# Altium project PCB_DOAN2.PrjPcb
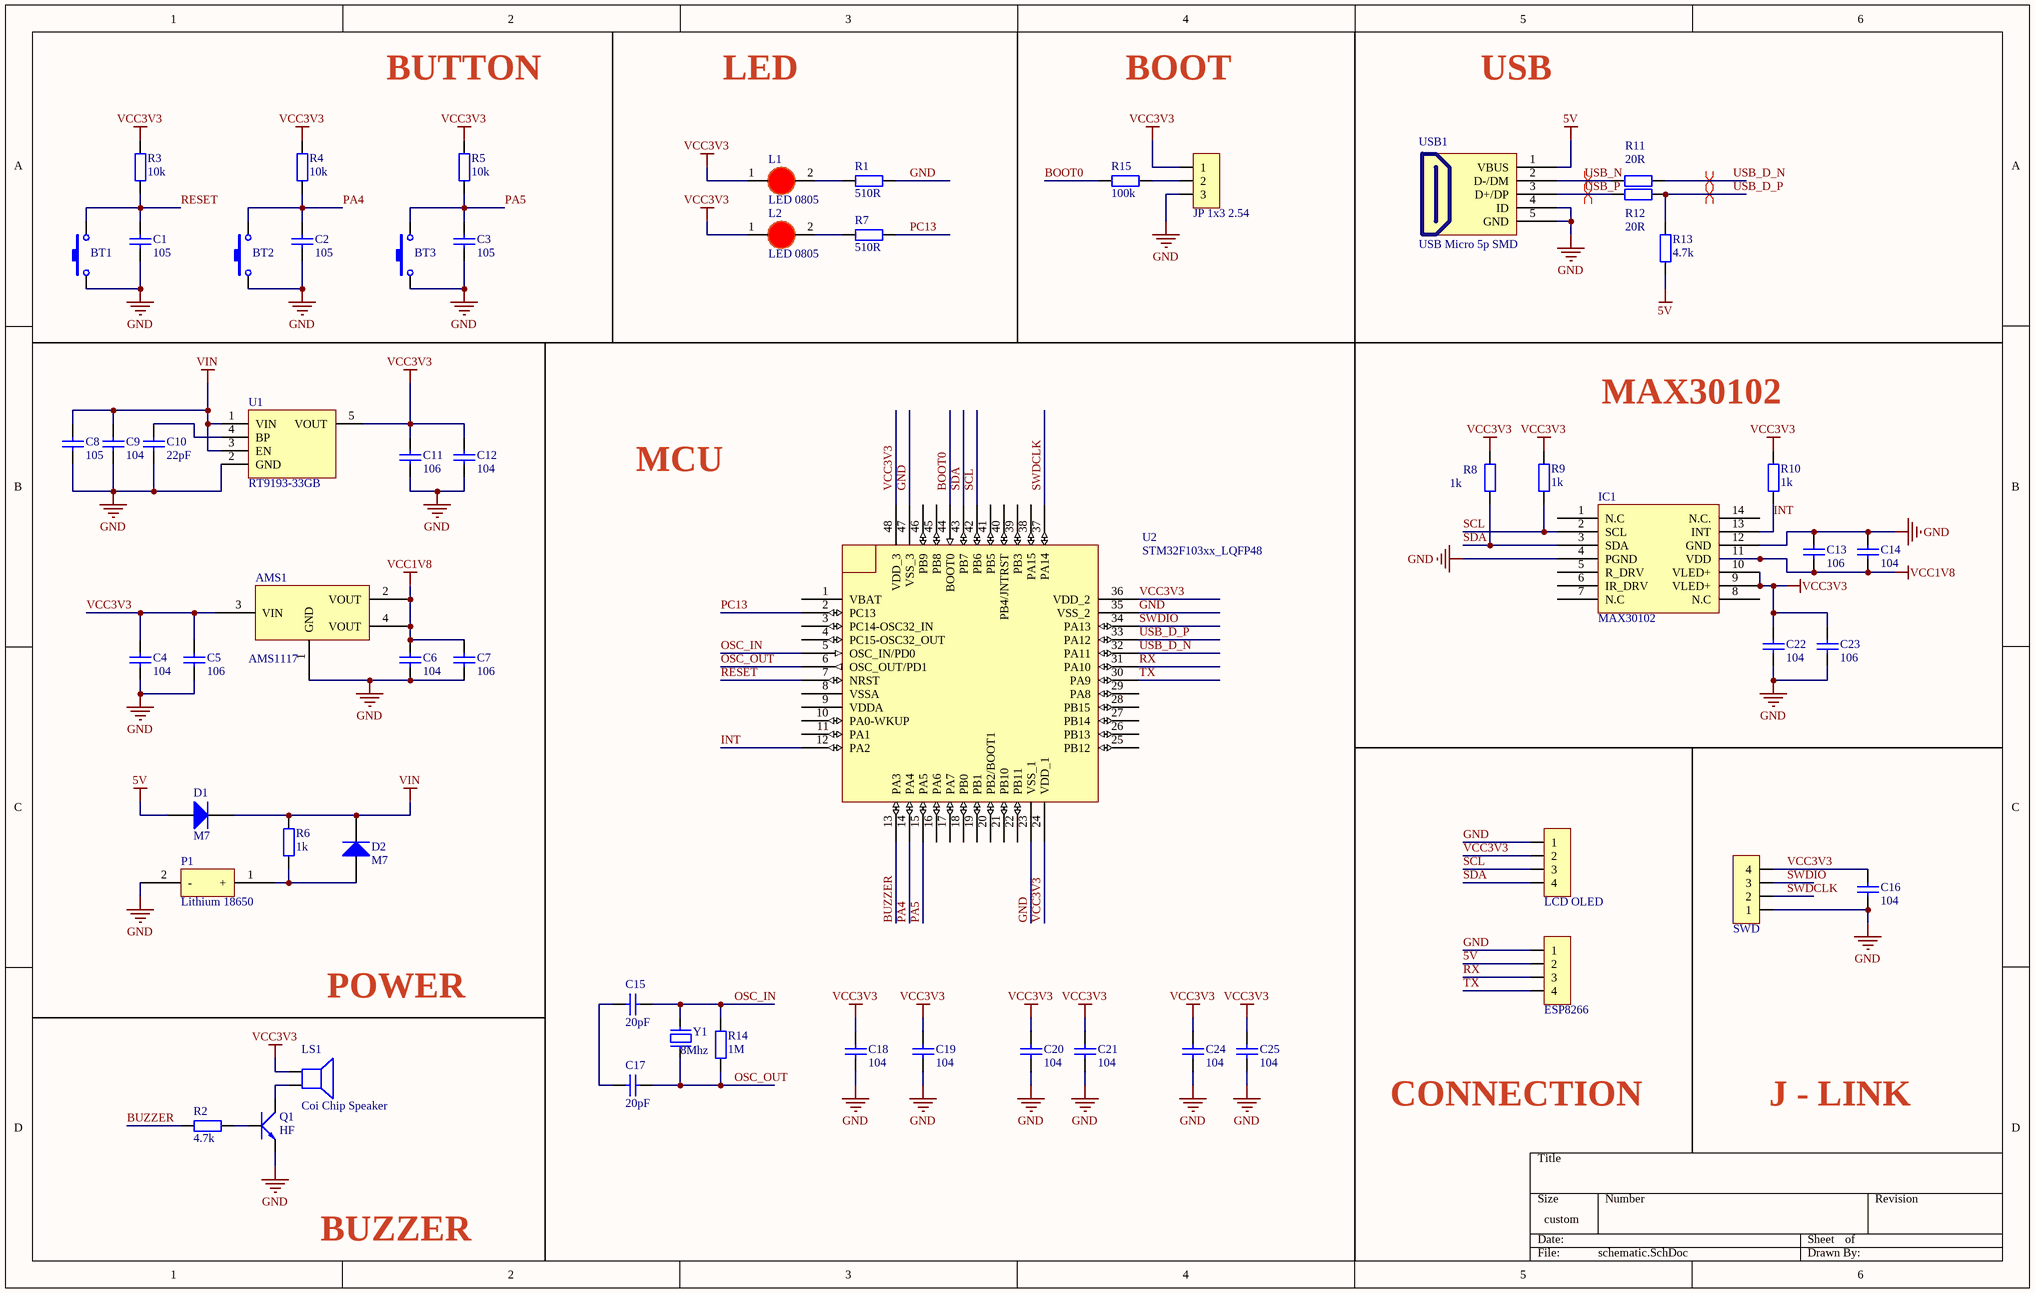
[diagram p0: schematic.SchDoc]
1 sheet, 60 parts. Net scope: global (net labels, ports and power ports of the same name join across sheets).
Board file: PCB1.PcbDoc

## Sheet schematic.SchDoc
size 381 x 241 mm; SheetNumber: 1; SheetTotal: 1

### Parts
AMS1  AMS1117  [SOT223]
BT1  Nut Nhan 2 Chan SMD 3x6x2.5  [Nut Nhan 2 Chan SMD 3x6x2.5]  (value not drawn)
BT2  Nut Nhan 2 Chan SMD 3x6x2.5  [Nut Nhan 2 Chan SMD 3x6x2.5]  (value not drawn)
BT3  Nut Nhan 2 Chan SMD 3x6x2.5  [Nut Nhan 2 Chan SMD 3x6x2.5]  (value not drawn)
C1  105  [tu 0603]
C2  105  [tu 0603]
C3  105  [tu 0603]
C4  104  [tu 0603]
C5  106  [tu 0603]
C6  104  [tu 0603]
C7  106  [tu 0603]
C8  105  [tu 0603]
C9  104  [tu 0603]
C10  22pF  [tu 0603]
C11  106  [tu 0603]
C12  104  [tu 0603]
C13  106  [tu 0603]
C14  104  [tu 0603]
C15  20pF  [tu 0805]
C16  104  [tu 0603]
C17  20pF  [tu 0805]
C18  104  [tu 0603]
C19  104  [tu 0603]
C20  104  [tu 0603]
C21  104  [tu 0603]
C22  104  [tu 0603]
C23  106  [tu 0603]
C24  104  [tu 0603]
C25  104  [tu 0603]
D1  M7  [DIODE SMA]
D2  M7  [DIODE SMA]
IC1  MAX30102  [Max30102]
JP1  SWD  [JP 1x4 DT]
JP2  LCD OLED  [JP 1x4 DT]
JP3  JP 1x3 2.54  [JP 1x3 DT]
JP4  ESP8266  [JP 1x4 DT]
L1  LED 0805  [LED-0805-Red]
L2  LED 0805  [LED-0805-Red]
LS1  Coi Chip Speaker  [Coi Chip Speacker]
P1  Lithium 18650  [18650_Lithium]
Q1  HF  [SOT-23]
R1  510R  [tro smd 0603]
R2  4.7k  [tro smd 0603]
R3  10k  [tro smd 0603]
R4  10k  [tro smd 0603]
R5  10k  [tro smd 0603]
R6  1k  [tro smd 0603]
R7  510R  [tro smd 0603]
R8  1k  [tro smd 0603]
R9  1k  [tro smd 0603]
R10  1k  [tro smd 0603]
R11  20R  [tro smd 0603]
R12  20R  [tro smd 0603]
R13  4.7k  [tro smd 0603]
R14  1M  [tro smd 0603]
R15  100k  [tro smd 0603]
U1  RT9193-33GB  [SOT23-5]
U2  STM32F103xx_LQFP48  [STM32_LQPF48]
USB1  USB Micro 5p SMD  [USB Micro 5p SMD]
Y1  8Mhz  [Thach Anh 2 chan SMD5032]

### Nets
5V: D1.1(A) JP4.2 R13.1 USB1.1(VBUS)
GND: AMS1.1(GND) BT1.1 BT2.1 BT3.1 C1.2 C2.2 C3.2 C4.1 C5.1 C6.1 C7.1 C8.2 C9.2 C10.2 C11.2 C12.2 C13.1 C14.1 C16.2 C18.2 C19.2 C20.2 C21.2 C22.1 C23.1 C24.2 C25.2 IC1.4(PGND) IC1.12(GND) JP1.1 JP2.1 JP3.3 JP4.1 P1.2(-) Q1.2(E) R1.2 U1.2(GND) U2.23(VSS_1) U2.35(VSS_2) U2.47(VSS_3) USB1.4(ID) USB1.5(GND)
VCC1V8: AMS1.2(VOUT) AMS1.4(VOUT) C6.2 C7.2 C13.2 C14.2 IC1.11(VDD)
VCC3V3: AMS1.3(VIN) C4.2 C5.2 C11.1 C12.1 C16.1 C18.1 C19.1 C20.1 C21.1 C22.2 C23.2 C24.1 C25.1 IC1.9(VLED+) IC1.10(VLED+) JP1.4 JP2.2 JP3.1 L1.1(A) L2.1(A) LS1.1 R3.2 R4.2 R5.2 R8.2 R9.1 R10.1 U1.5(VOUT) U2.24(VDD_1) U2.36(VDD_2) U2.48(VDD_3)
VIN: C8.1 C9.1 D1.2(K) D2.2(K) R6.2 U1.1(VIN) U1.3(EN)
BOOT0: R15.1 U2.44(BOOT0)
BUZZER: R2.1 U2.13(PA3)
INT: IC1.13(INT) R10.2 U2.12(PA2)
OSC_IN: C15.1 R14.2 U2.5(OSC_IN/PD0) Y1.2
OSC_OUT: C17.1 R14.1 U2.6(OSC_OUT/PD1) Y1.1
PA4: BT2.2 C2.1 R4.1 U2.14(PA4)
PA5: BT3.2 C3.1 R5.1 U2.15(PA5)
PC13: R7.2 U2.2(PC13)
RESET: BT1.2 C1.1 R3.1 U2.7(NRST)
RX: JP4.3 U2.31(PA10)
SCL: IC1.2(SCL) JP2.3 R9.2 U2.42(PB6)
SDA: IC1.3(SDA) JP2.4 R8.1 U2.43(PB7)
SWDCLK: JP1.2 U2.37(PA14)
SWDIO: JP1.3 U2.34(PA13)
TX: JP4.4 U2.30(PA9)
USB_D_N: R11.2 U2.32(PA11)
USB_D_P: R12.2 R13.2 U2.33(PA12)
USB_N: R11.1 USB1.2(D-/DM)
USB_P: R12.1 USB1.3(D+/DP)
NetC10_1: C10.1 U1.4(BP)
NetC15_2: C15.2 C17.2
NetD2_1: D2.1(A) P1.1(+) R6.1
NetJP3_2: JP3.2 R15.2
NetL1_2: L1.2(K) R1.1
NetL2_2: L2.2(K) R7.1
NetLS1_2: LS1.2 Q1.3(C)
NetQ1_1: Q1.1(B) R2.2

Not connected (* = marked no-connect by the designer): IC1 1(N.C) 5(R_DRV) 6(IR_DRV) 7(N.C) 8(N.C) 14(N.C.); U2 1(VBAT) 3(PC14-OSC32_IN) 4(PC15-OSC32_OUT) 8(VSSA) 9(VDDA) 10(PA0-WKUP) 11(PA1) 16(PA6) 17(PA7) 18(PB0) 19(PB1) 20(PB2/BOOT1) 21(PB10) 22(PB11) 25(PB12) 26(PB13) 27(PB14) 28(PB15) 29(PA8) 38(PA15) 39(PB3) 40(PB4/JNTRST) 41(PB5) 45(PB8) 46(PB9)

### Layout directives
differential pair: USB_D_N, USB_D_P, USB_N, USB_P

### Notes on the sheet
- BUTTON
- LED
- BOOT
- USB
- MAX30102
- MCU
- POWER
- CONNECTION
- J - LINK
- BUZZER

### Library data of the parts
AMS1 = AMS1117 SMD: Dán; Value: AMS1117-3.3V SOT223; Don_Vi: Con; Ma_Hang: MH000596; Ghi_Chu: *; Kieu_Chan: *; Chung_Loai: Dán
BT1-BT3 = Nut Nhan 2 Chan SMD 3x6x2.5: Ma_Hang: MH001036; Ten: Nút Nhấn 2 Chân 3x6x2.5MM SMD
C1-C3 = Tu 0603 105 50V 10%: Dán; Don_Vi: Con; So_Chan: 2; Ten_Linh_Kien: Tụ 0603 105-1uF 50V 10%; Ma_Hang: MH004569; Chung_Loai: Dán; Kieu_Chan: *
C4 C6 C9 C12 C14 C16 C18-C22 C24 C25 = Tu 0603 104 50V 10%: Dán; Don_Vi: Con; So_Chan: 2; Ten_Linh_Kien: Tụ 0603 104-100nF 10% 50V; Ma_Hang: MH004568; Chung_Loai: Dán; Kieu_Chan: *
C5 C7 C11 C13 C23 = Tu 0603 106 16V 20%: Dán; Don_Vi: Con; So_Chan: 2; Ten_Linh_Kien: Tụ 0603-10uF 20% 16V; Ma_Hang: MH004848; Chung_Loai: Dán; Kieu_Chan: *
C8 = Tu 0603 105 16V 20%: Dán; Don_Vi: Con; So_Chan: 2; Ten_Linh_Kien: Tụ 0603 105-1uF 20% 16V; Ma_Hang: MH004574; Chung_Loai: Dán; Kieu_Chan: *
C10 = Tu 0603 22pF 50V 10%: Dán; Don_Vi: Con; So_Chan: 2; Ten_Linh_Kien: Tụ 0603 22pF 50V 10%; Ma_Hang: MH004570; Chung_Loai: Dán; Kieu_Chan: *
C15 C17 = Tu 0805 20pF 50V 10%: Dán; Don_Vi: Con; Ten_Linh_Kien: Tụ 0805 20P 10% 50V; So_Chan: 2; Ma_Hang: MH004558; Chung_Loai: Dán; Kieu_Chan: *
D1 D2 = Diode M7 ( 4007 ): Dán; Don_Vi: Con; Ten_Linh_Kien: Diode M7 1N4007 SMD 1A 1000V; Ma_Hang: MH000944; Chung_Loai: Dán; Ghi_Chu: *
JP1 JP2 JP4 = JP 1x4 2.54 Duc Thang: Cắm; Ten_Linh_Kien: Jump Đơn Đực 2.54MM 1x40P Thẳng 11MM; Don_Vi: Con; Ma_Hang: MH000903; Ghi_Chu: *; Kieu_Chan: *; Chung_Loai: Cắm
JP3 = JP 1x3 2.54 Duc Thang: Cắm; Ten_Linh_Kien: Jump Đơn Đực 2.54MM 1x40P Thẳng 11MM; Don_Vi: Con; Ma_Hang: MH000903; Ghi_Chu: *; Kieu_Chan: *; Chung_Loai: Cắm
L1 L2 = LED 0805 Do: Dán; Don_Vi: Con; Ma_Hang: MH000897; Ten_Linh_Kien: LED 0805 Màu Đỏ (Red); Ghi_Chu: *; Kieu_Chan: *; Chung_Loai: Dán
LS1 = Coi Chip Speaker: Còi chip
Q1 = Trans C1815 HF SMD: SOT-23; Value: C9014
R1 R7 = Tro 0603 5% 510R: Dán; Don_Vi: Con; So_Chan: 2; Ten_Linh_Kien: Trở 0603 5% 510R; Ma_Hang: MH007667; Chung_Loai: Dán; Kieu_Chan: *
R2 R8-R10 R13 = Tro 0603 5% 4.7k: Dán; Don_Vi: Con; So_Chan: 2; Ten_Linh_Kien: Trở 0603 5% 4.7k; Ma_Hang: MH006327; Chung_Loai: Dán; Kieu_Chan: *
R3-R5 = Tro 0603 1% 10k: Dán; Don_Vi: Con; So_Chan: 2; Ten_Linh_Kien: Trở 0603 1% 10k; Ma_Hang: MH006333; Chung_Loai: Dán; Kieu_Chan: *
R6 = Tro 0603 5% 1k: Dán; Don_Vi: Con; So_Chan: 2; Ten_Linh_Kien: Trở 0603 5% 1k; Ma_Hang: MH006319; Chung_Loai: Dán; Kieu_Chan: *
R11 R12 = Tro 0603 5% 22R: Dán; Don_Vi: Con; So_Chan: 2; Ten_Linh_Kien: Trở 0603 5% 22R; Ma_Hang: MH006331; Chung_Loai: Dán; Kieu_Chan: *
R14 = Tro 0603 5% 1M: Dán; Don_Vi: Con; So_Chan: 2; Ten_Linh_Kien: Trở 0603 5% 1M; Ma_Hang: MH006909; Chung_Loai: Dán; Kieu_Chan: *
R15 = Tro 0603 5% 100k: Dán; So_Chan: 2; Ten_Linh_Kien: Trở 0603 5% 100k; Ma_Hang: MH006314; Don_Vi: Con; Chung_Loai: Dán; Kieu_Chan: *
U1 = REG_5.5V-3.3V-0.3A-1W-SOT-23-5: Linear Voltage Regulator IC 1 Output 300mA SOT-23-5; Manufacturer: Richtek USA Inc.; Alternate Part Number-1: NA; Manufacturer Part Number: RT9193-33GB; Supplier-1: LCSC; Supplier Part Number-1: C15651; Case/Package: SOT-23-5
USB1 = USB Micro 5p SMD: USB Type B; Ten: MicroUSB MK5P SMD; Ma_Hang: MH001020
Y1 = Thach Anh 2 chan SMD 5032: Crystal For all Crystal 2pin.; Value: 4Mhz
U2 = STM32F103xx_LQFP48: Published: 30-May-2008; DatasheetVersion: rev6, Mar-2008; PackageVersion: Mar-2008; PackageReference: LQFP48; Publisher: Altium Limited; PackageDescription: 48-Pin Low-Profile Quad Flat Pack, 7 x 7 mm Body, 0.5 mm Pitch (LQFP48); ComponentLink1Description: Manufacturer Link; ComponentLink1URL: www.st.com/stm32; ComponentLink2Description: Datasheet; ComponentLink2URL: http://www.st.com/stonline/products/literature/ds/13587.pdf